# Altium schematic sheet Overview_Schematic.SchDoc: Access Control
size A3; Project: Bluetooth Gateway; ENG_APP_DATE: --/--/--; DSN_APP_DATE: --/--/--; CHK_APP_DATE: --/--/--; DrawnBy: Q.Thang & T.Khoa; Revision: V1.0.1; SheetNumber: 1; SheetTotal: 16
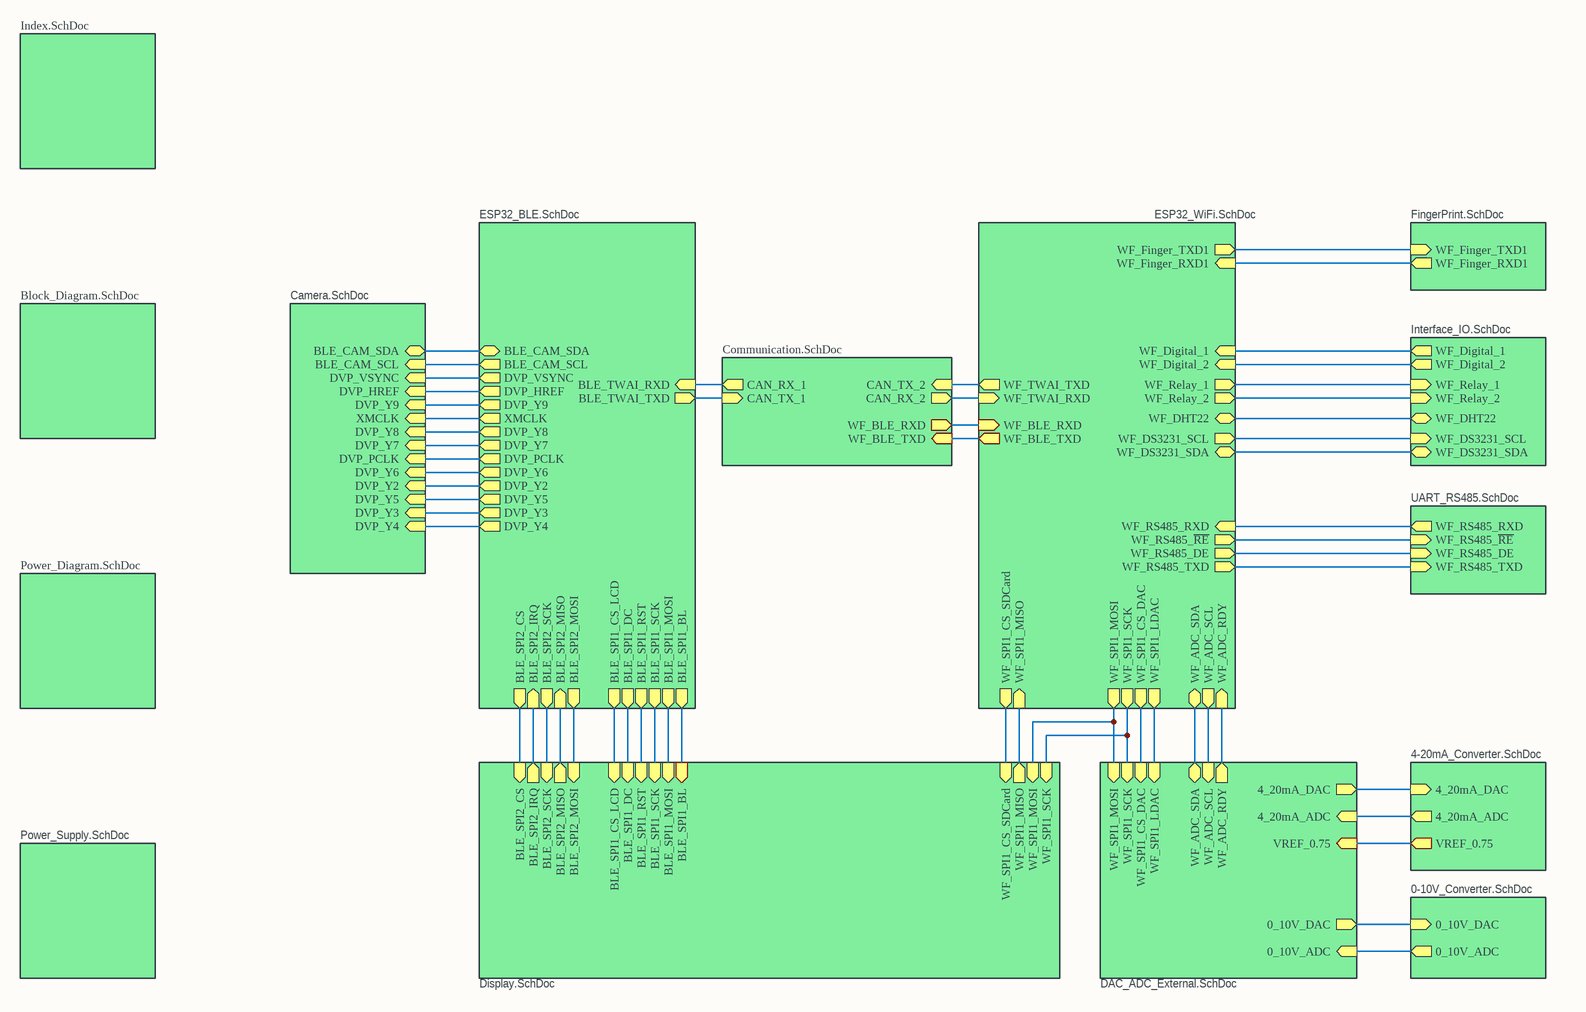
[diagram p0: Overview_Schematic.SchDoc]

## Sub-sheets
Designator = ESP32_BLE.SchDoc: BLE_CAM_SDA (bidir), BLE_CAM_SCL (out), DVP_VSYNC (out), DVP_HREF (out), DVP_Y9 (out), XMCLK (out), DVP_Y8 (out), DVP_Y7 (out), DVP_PCLK (out), DVP_Y6 (out), DVP_Y2 (out), DVP_Y5 (out), DVP_Y3 (out), DVP_Y4 (out), BLE_SPI1_DC (out), BLE_SPI1_SCK (out), BLE_SPI1_MOSI (out), BLE_SPI1_RST (out), BLE_SPI1_CS_LCD (out), BLE_SPI2_MOSI (out), BLE_SPI2_MISO (in), BLE_SPI2_SCK (out), BLE_SPI2_IRQ (in), BLE_SPI2_CS (out), BLE_TWAI_RXD (in), BLE_TWAI_TXD (out), BLE_SPI1_BL (out)
Designator = ESP32_WiFi.SchDoc: WF_SPI1_MOSI (out), WF_SPI1_SCK (out), WF_SPI1_CS_DAC (out), WF_SPI1_LDAC (out), WF_RS485_RXD (in), WF_RS485_~{RE} (out), WF_RS485_DE (out), WF_RS485_TXD (out), WF_Digital_1 (in), WF_Digital_2 (in), WF_Relay_1 (out), WF_Relay_2 (out), WF_DHT22 (bidir), WF_DS3231_SCL (out), WF_DS3231_SDA (bidir), WF_Finger_TXD1 (out), WF_Finger_RXD1 (in), WF_TWAI_TXD (out), WF_TWAI_RXD (in), WF_SPI1_MISO (in), WF_SPI1_CS_SDCard (out), WF_ADC_SDA (bidir), WF_ADC_SCL (out), WF_ADC_RDY (in), WF_BLE_RXD (in), WF_BLE_TXD (out)
Designator = Power_Supply.SchDoc: no entries
Designator = DAC_ADC_External.SchDoc: WF_SPI1_MOSI (in), WF_SPI1_SCK (in), WF_SPI1_CS_DAC (in), WF_SPI1_LDAC (in), 4_20mA_DAC (out), 4_20mA_ADC (in), 0_10V_ADC (in), 0_10V_DAC (out), WF_ADC_SDA (bidir), WF_ADC_SCL (in), WF_ADC_RDY (out), VREF_0.75 (in)
Designator = 4-20mA_Converter.SchDoc: 4_20mA_DAC (in), 4_20mA_ADC (out), VREF_0.75 (out)
Designator = 0-10V_Converter.SchDoc: 0_10V_DAC (in), 0_10V_ADC (out)
Designator = UART_RS485.SchDoc: WF_RS485_RXD (out), WF_RS485_~{RE} (in), WF_RS485_DE (in), WF_RS485_TXD (in)
Designator = Camera.SchDoc: BLE_CAM_SDA (bidir), BLE_CAM_SCL (in), DVP_VSYNC (in), DVP_HREF (in), DVP_Y9 (in), XMCLK (in), DVP_Y8 (in), DVP_Y7 (in), DVP_PCLK (in), DVP_Y6 (in), DVP_Y2 (in), DVP_Y5 (in), DVP_Y3 (in), DVP_Y4 (in)
Designator = Display.SchDoc: BLE_SPI1_MOSI (in), BLE_SPI1_SCK (in), BLE_SPI1_CS_LCD (in), BLE_SPI1_DC (in), BLE_SPI1_RST (in), BLE_SPI2_MOSI (in), BLE_SPI2_MISO (out), BLE_SPI2_SCK (in), BLE_SPI2_IRQ (out), BLE_SPI2_CS (in), WF_SPI1_MOSI (in), WF_SPI1_SCK (in), WF_SPI1_CS_SDCard (in), WF_SPI1_MISO (out), BLE_SPI1_BL (in)
Designator = Interface_IO.SchDoc: WF_Digital_1 (out), WF_Digital_2 (out), WF_Relay_1 (in), WF_Relay_2 (in), WF_DHT22 (bidir), WF_DS3231_SCL (in), WF_DS3231_SDA (bidir)
Designator = FingerPrint.SchDoc: WF_Finger_RXD1 (out), WF_Finger_TXD1 (in)
Designator = Block_Diagram.SchDoc: no entries
Designator = Index.SchDoc: no entries
Designator = Power_Diagram.SchDoc: no entries
Designator = Communication.SchDoc: CAN_RX_1 (out), CAN_TX_1 (in), CAN_RX_2 (out), CAN_TX_2 (in), WF_BLE_RXD (out), WF_BLE_TXD (in)

## Nets
(unnamed): sheet Designator/BLE_CAM_SDA, sheet Designator/BLE_CAM_SDA
(unnamed): sheet Designator/BLE_CAM_SCL, sheet Designator/BLE_CAM_SCL
(unnamed): sheet Designator/DVP_VSYNC, sheet Designator/DVP_VSYNC
(unnamed): sheet Designator/DVP_HREF, sheet Designator/DVP_HREF
(unnamed): sheet Designator/DVP_Y9, sheet Designator/DVP_Y9
(unnamed): sheet Designator/XMCLK, sheet Designator/XMCLK
(unnamed): sheet Designator/DVP_Y8, sheet Designator/DVP_Y8
(unnamed): sheet Designator/DVP_Y7, sheet Designator/DVP_Y7
(unnamed): sheet Designator/DVP_PCLK, sheet Designator/DVP_PCLK
(unnamed): sheet Designator/DVP_Y6, sheet Designator/DVP_Y6
(unnamed): sheet Designator/DVP_Y2, sheet Designator/DVP_Y2
(unnamed): sheet Designator/DVP_Y5, sheet Designator/DVP_Y5
(unnamed): sheet Designator/DVP_Y3, sheet Designator/DVP_Y3
(unnamed): sheet Designator/DVP_Y4, sheet Designator/DVP_Y4
(unnamed): sheet Designator/BLE_SPI1_DC, sheet Designator/BLE_SPI1_DC
(unnamed): sheet Designator/BLE_SPI1_SCK, sheet Designator/BLE_SPI1_SCK
(unnamed): sheet Designator/BLE_SPI1_MOSI, sheet Designator/BLE_SPI1_MOSI
(unnamed): sheet Designator/BLE_SPI1_RST, sheet Designator/BLE_SPI1_RST
(unnamed): sheet Designator/BLE_SPI1_CS_LCD, sheet Designator/BLE_SPI1_CS_LCD
(unnamed): sheet Designator/BLE_SPI2_MOSI, sheet Designator/BLE_SPI2_MOSI
(unnamed): sheet Designator/BLE_SPI2_MISO, sheet Designator/BLE_SPI2_MISO
(unnamed): sheet Designator/BLE_SPI2_SCK, sheet Designator/BLE_SPI2_SCK
(unnamed): sheet Designator/BLE_SPI2_IRQ, sheet Designator/BLE_SPI2_IRQ
(unnamed): sheet Designator/BLE_SPI2_CS, sheet Designator/BLE_SPI2_CS
(unnamed): sheet Designator/BLE_TWAI_RXD, sheet Designator/CAN_RX_1
(unnamed): sheet Designator/BLE_TWAI_TXD, sheet Designator/CAN_TX_1
(unnamed): sheet Designator/BLE_SPI1_BL, sheet Designator/BLE_SPI1_BL
(unnamed): sheet Designator/WF_SPI1_MOSI, sheet Designator/WF_SPI1_MOSI, sheet Designator/WF_SPI1_MOSI
(unnamed): sheet Designator/WF_SPI1_SCK, sheet Designator/WF_SPI1_SCK, sheet Designator/WF_SPI1_SCK
(unnamed): sheet Designator/WF_SPI1_CS_DAC, sheet Designator/WF_SPI1_CS_DAC
(unnamed): sheet Designator/WF_SPI1_LDAC, sheet Designator/WF_SPI1_LDAC
(unnamed): sheet Designator/WF_RS485_RXD, sheet Designator/WF_RS485_RXD
(unnamed): sheet Designator/WF_RS485_~{RE}, sheet Designator/WF_RS485_~{RE}
(unnamed): sheet Designator/WF_RS485_DE, sheet Designator/WF_RS485_DE
(unnamed): sheet Designator/WF_RS485_TXD, sheet Designator/WF_RS485_TXD
(unnamed): sheet Designator/WF_Digital_1, sheet Designator/WF_Digital_1
(unnamed): sheet Designator/WF_Digital_2, sheet Designator/WF_Digital_2
(unnamed): sheet Designator/WF_Relay_1, sheet Designator/WF_Relay_1
(unnamed): sheet Designator/WF_Relay_2, sheet Designator/WF_Relay_2
(unnamed): sheet Designator/WF_DHT22, sheet Designator/WF_DHT22
(unnamed): sheet Designator/WF_DS3231_SCL, sheet Designator/WF_DS3231_SCL
(unnamed): sheet Designator/WF_DS3231_SDA, sheet Designator/WF_DS3231_SDA
(unnamed): sheet Designator/WF_Finger_TXD1, sheet Designator/WF_Finger_TXD1
(unnamed): sheet Designator/WF_Finger_RXD1, sheet Designator/WF_Finger_RXD1
(unnamed): sheet Designator/WF_TWAI_TXD, sheet Designator/CAN_TX_2
(unnamed): sheet Designator/WF_TWAI_RXD, sheet Designator/CAN_RX_2
(unnamed): sheet Designator/WF_SPI1_MISO, sheet Designator/WF_SPI1_MISO
(unnamed): sheet Designator/WF_SPI1_CS_SDCard, sheet Designator/WF_SPI1_CS_SDCard
(unnamed): sheet Designator/WF_ADC_SDA, sheet Designator/WF_ADC_SDA
(unnamed): sheet Designator/WF_ADC_SCL, sheet Designator/WF_ADC_SCL
(unnamed): sheet Designator/WF_ADC_RDY, sheet Designator/WF_ADC_RDY
(unnamed): sheet Designator/WF_BLE_RXD, sheet Designator/WF_BLE_RXD
(unnamed): sheet Designator/WF_BLE_TXD, sheet Designator/WF_BLE_TXD
(unnamed): sheet Designator/4_20mA_DAC, sheet Designator/4_20mA_DAC
(unnamed): sheet Designator/4_20mA_ADC, sheet Designator/4_20mA_ADC
(unnamed): sheet Designator/0_10V_ADC, sheet Designator/0_10V_ADC
(unnamed): sheet Designator/0_10V_DAC, sheet Designator/0_10V_DAC
(unnamed): sheet Designator/VREF_0.75, sheet Designator/VREF_0.75

## Notes on the sheet
- Project Name
- Size
- A3
- Revision
- Checked By:
- Drawn By:
- Date:
- File:
- Last Modified:
- Sheet
- of